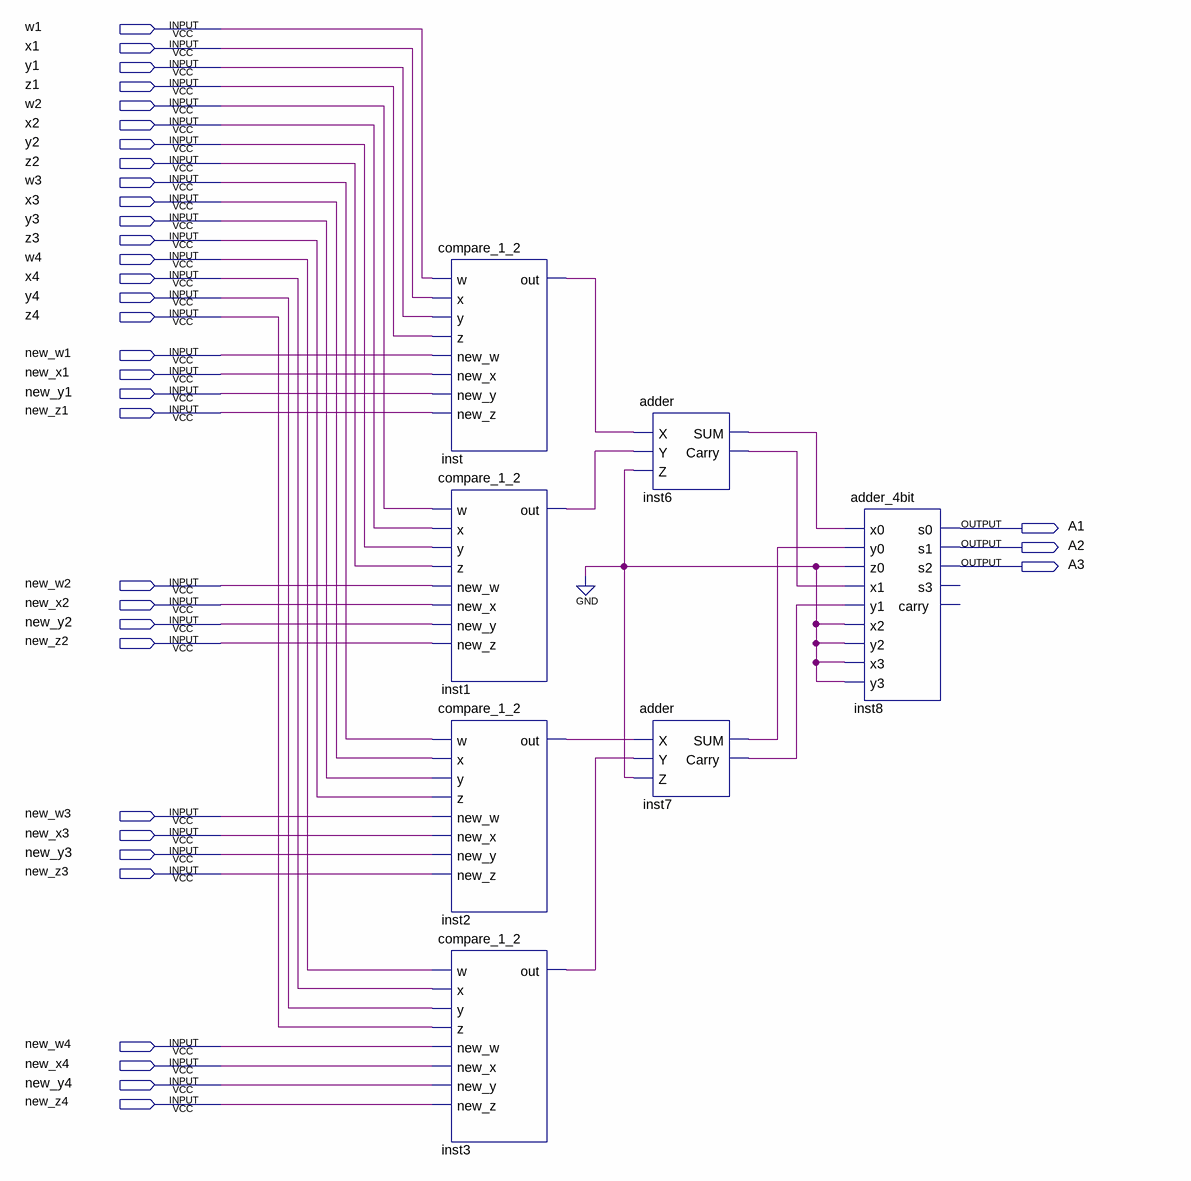
[diagram p0: schematic sheet]
// Quartus schematic XA.bdf as structural Verilog: 7 symbols, 35 pins
module XA (
  input  w1,
  input  x1,
  input  y1,
  input  z1,
  input  w2,
  input  x2,
  input  y2,
  input  z2,
  input  w3,
  input  x3,
  input  y3,
  input  z3,
  input  w4,
  input  x4,
  input  y4,
  input  z4,
  input  new_w1,
  input  new_x1,
  input  new_y1,
  input  new_z1,
  input  new_w2,
  input  new_x2,
  input  new_y2,
  input  new_z2,
  input  new_w3,
  input  new_x3,
  input  new_y3,
  input  new_z3,
  input  new_w4,
  input  new_x4,
  input  new_y4,
  input  new_z4,
  output A1,
  output A2,
  output A3
);

  wire inst1_out, inst2_out, inst3_out, inst6_carry, inst6_sum, inst7_carry, inst7_sum, inst_out;

  compare_1_2 inst (
    .w(w1), .x(x1), .y(y1), .z(z1), .new_w(new_w1), .new_x(new_x1), .new_y(new_y1), .new_z(new_z1),
    .out(inst_out));
  compare_1_2 inst1 (
    .w(w2), .x(x2), .y(y2), .z(z2), .new_w(new_w2), .new_x(new_x2), .new_y(new_y2), .new_z(new_z2),
    .out(inst1_out));
  compare_1_2 inst2 (
    .w(w3), .x(x3), .y(y3), .z(z3), .new_w(new_w3), .new_x(new_x3), .new_y(new_y3), .new_z(new_z3),
    .out(inst2_out));
  compare_1_2 inst3 (
    .w(w4), .x(x4), .y(y4), .z(z4), .new_w(new_w4), .new_x(new_x4), .new_y(new_y4), .new_z(new_z4),
    .out(inst3_out));
  adder inst6 (.X(inst_out), .Y(inst1_out), .Z(1'b0), .SUM(inst6_sum), .Carry(inst6_carry));
  adder inst7 (.X(inst2_out), .Y(inst3_out), .Z(1'b0), .SUM(inst7_sum), .Carry(inst7_carry));
  adder_4bit inst8 (
    .x0(inst6_sum), .y0(inst7_sum), .z0(1'b0), .x1(inst6_carry), .y1(inst7_carry), .x2(1'b0), .y2(1'b0),
    .x3(1'b0), .y3(1'b0), .s0(A1), .s1(A2), .s2(A3));  // open: s3, carry
endmodule
